# Altium schematic sheet FPGA_Connector_1.SchDoc: BXZ7C01: FPGA Connector 1
size A3; CompanyName: GVI; Address2: 杭州言曼科技有限公司; Address3: www.gvi-tech.com; DocumentNumber: BXZ7C01; Revision: A; SheetNumber: 6; SheetTotal: 10
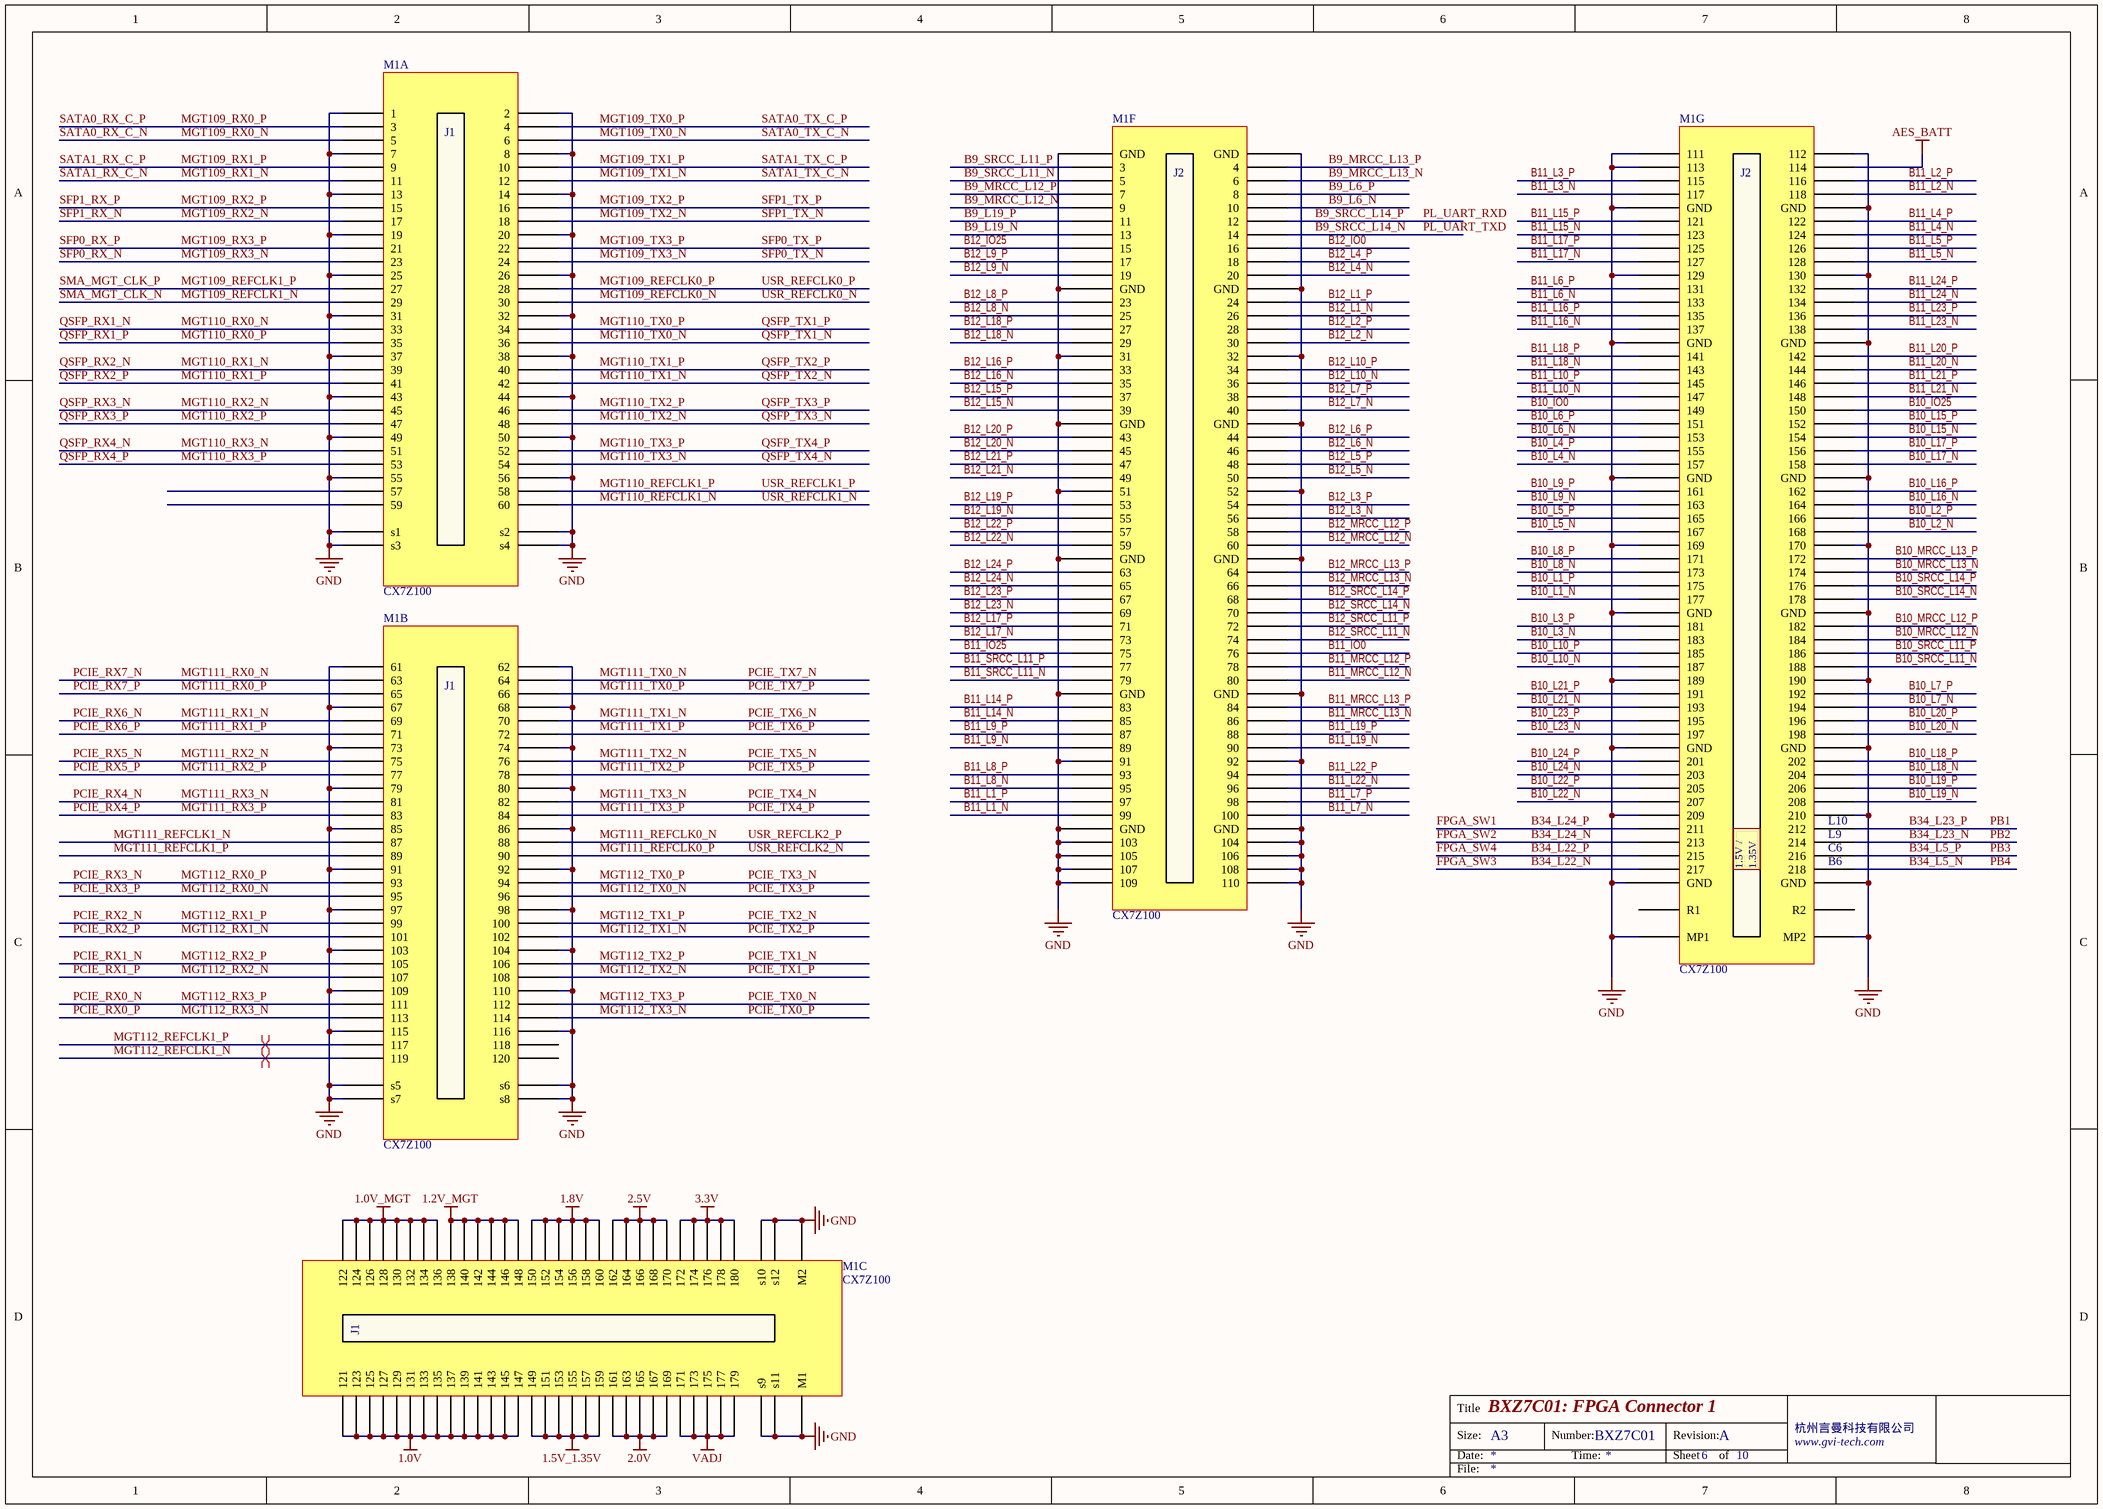
[diagram p0: FPGA_Connector_1.SchDoc]

## Parts
M1  CX7Z100  [GVI_Z7_MiniModule_Socket]  (parts A,B,C,F,G of 8)

## Nets
1.0V: M1.121 M1.123 M1.125 M1.127 M1.129 M1.131 M1.133 M1.135 M1.137 M1.139 M1.141 M1.143 M1.145 M1.147
1.0V_MGT: M1.122 M1.124 M1.126 M1.128 M1.130 M1.132 M1.134 M1.136
1.2V_MGT: M1.138 M1.140 M1.142 M1.144 M1.146 M1.148
1.5V_1.35V: M1.149 M1.151 M1.153 M1.155 M1.157 M1.159
1.8V: M1.150 M1.152 M1.154 M1.156 M1.158 M1.160
2.0V: M1.161 M1.163 M1.165 M1.167 M1.169
2.5V: M1.162 M1.164 M1.166 M1.168 M1.170
3.3V: M1.172 M1.174 M1.176 M1.178 M1.180
AES_BATT: M1.B114(114)
GND: M1.1 M1.2 M1.7 M1.8 M1.13 M1.14 M1.19 M1.20 M1.25 M1.26 M1.31 M1.32 M1.37 M1.38 M1.43 M1.44 M1.49 M1.50 M1.55 M1.56 M1.61 M1.62 M1.67 M1.68 M1.73 M1.74 M1.79 M1.80 M1.85 M1.86 M1.91 M1.92 M1.97 M1.98 M1.103 M1.104 M1.109 M1.110 M1.115 M1.116 M1.B1(GND) M1.B2(GND) M1.B21(GND) M1.B22(GND) M1.B31(31) M1.B32(32) M1.B41(GND) M1.B42(GND) M1.B51(51) M1.B52(52) M1.B61(GND) M1.B62(GND) M1.B81(GND) M1.B82(GND) M1.B91(91) M1.B92(92) M1.B101(GND) M1.B102(GND) M1.B103(103) M1.B104(104) M1.B105(105) M1.B106(106) M1.B107(107) M1.B108(108) M1.B109(109) M1.B110(110) M1.B111(111) M1.B112(112) M1.B113(113) M1.B119(GND) M1.B120(GND) M1.B129(129) M1.B130(130) M1.B139(GND) M1.B140(GND) M1.B159(GND) M1.B160(GND) M1.B169(169) M1.B170(170) M1.B179(GND) M1.B180(GND) M1.B189(189) M1.B190(190) M1.B199(GND) M1.B200(GND) M1.B209(209) M1.B210(210) M1.B219(GND) M1.B220(GND) M1.BMP1(MP1) M1.BMP2(MP2) M1.M1 M1.M2 M1.s1 M1.s2 M1.s3 M1.s4 M1.s5 M1.s6 M1.s7 M1.s8 M1.s9 M1.s10 M1.s11 M1.s12
VADJ: M1.171 M1.173 M1.175 M1.177 M1.179
B9_L6_N: M1.B10(10)
B9_L6_P: M1.B8(8)
B9_L19_N: M1.B13(13)
B9_L19_P: M1.B11(11)
B9_MRCC_L12_N: M1.B9(9)
B9_MRCC_L12_P: M1.B7(7)
B9_MRCC_L13_N: M1.B6(6)
B9_MRCC_L13_P: M1.B4(4)
B9_SRCC_L11_N: M1.B5(5)
B9_SRCC_L11_P: M1.B3(3)
B9_SRCC_L14_N: M1.B14(14)  [also labelled PL_UART_TXD]
B9_SRCC_L14_P: M1.B12(12)  [also labelled PL_UART_RXD]
B10_IO0: M1.B149(149)
B10_IO25: M1.B150(150)
B10_L1_N: M1.B177(177)
B10_L1_P: M1.B175(175)
B10_L2_N: M1.B168(168)
B10_L2_P: M1.B166(166)
B10_L3_N: M1.B183(183)
B10_L3_P: M1.B181(181)
B10_L4_N: M1.B157(157)
B10_L4_P: M1.B155(155)
B10_L5_N: M1.B167(167)
B10_L5_P: M1.B165(165)
B10_L6_N: M1.B153(153)
B10_L6_P: M1.B151(151)
B10_L7_N: M1.B194(194)
B10_L7_P: M1.B192(192)
B10_L8_N: M1.B173(173)
B10_L8_P: M1.B171(171)
B10_L9_N: M1.B163(163)
B10_L9_P: M1.B161(161)
B10_L10_N: M1.B187(187)
B10_L10_P: M1.B185(185)
B10_L15_N: M1.B154(154)
B10_L15_P: M1.B152(152)
B10_L16_N: M1.B164(164)
B10_L16_P: M1.B162(162)
B10_L17_N: M1.B158(158)
B10_L17_P: M1.B156(156)
B10_L18_N: M1.B204(204)
B10_L18_P: M1.B202(202)
B10_L19_N: M1.B208(208)
B10_L19_P: M1.B206(206)
B10_L20_N: M1.B198(198)
B10_L20_P: M1.B196(196)
B10_L21_N: M1.B193(193)
B10_L21_P: M1.B191(191)
B10_L22_N: M1.B207(207)
B10_L22_P: M1.B205(205)
B10_L23_N: M1.B197(197)
B10_L23_P: M1.B195(195)
B10_L24_N: M1.B203(203)
B10_L24_P: M1.B201(201)
B10_MRCC_L12_N: M1.B184(184)
B10_MRCC_L12_P: M1.B182(182)
B10_MRCC_L13_N: M1.B174(174)
B10_MRCC_L13_P: M1.B172(172)
B10_SRCC_L11_N: M1.B188(188)
B10_SRCC_L11_P: M1.B186(186)
B10_SRCC_L14_N: M1.B178(178)
B10_SRCC_L14_P: M1.B176(176)
B11_IO0: M1.B76(76)
B11_IO25: M1.B75(75)
B11_L1_N: M1.B99(99)
B11_L1_P: M1.B97(97)
B11_L2_N: M1.B118(118)
B11_L2_P: M1.B116(116)
B11_L3_N: M1.B117(117)
B11_L3_P: M1.B115(115)
B11_L4_N: M1.B124(124)
B11_L4_P: M1.B122(122)
B11_L5_N: M1.B128(128)
B11_L5_P: M1.B126(126)
B11_L6_N: M1.B133(133)
B11_L6_P: M1.B131(131)
B11_L7_N: M1.B100(100)
B11_L7_P: M1.B98(98)
B11_L8_N: M1.B95(95)
B11_L8_P: M1.B93(93)
B11_L9_N: M1.B89(89)
B11_L9_P: M1.B87(87)
B11_L10_N: M1.B147(147)
B11_L10_P: M1.B145(145)
B11_L14_N: M1.B85(85)
B11_L14_P: M1.B83(83)
B11_L15_N: M1.B123(123)
B11_L15_P: M1.B121(121)
B11_L16_N: M1.B137(137)
B11_L16_P: M1.B135(135)
B11_L17_N: M1.B127(127)
B11_L17_P: M1.B125(125)
B11_L18_N: M1.B143(143)
B11_L18_P: M1.B141(141)
B11_L19_N: M1.B90(90)
B11_L19_P: M1.B88(88)
B11_L20_N: M1.B144(144)
B11_L20_P: M1.B142(142)
B11_L21_N: M1.B148(148)
B11_L21_P: M1.B146(146)
B11_L22_N: M1.B96(96)
B11_L22_P: M1.B94(94)
B11_L23_N: M1.B138(138)
B11_L23_P: M1.B136(136)
B11_L24_N: M1.B134(134)
B11_L24_P: M1.B132(132)
B11_MRCC_L12_N: M1.B80(80)
B11_MRCC_L12_P: M1.B78(78)
B11_MRCC_L13_N: M1.B86(86)
B11_MRCC_L13_P: M1.B84(84)
B11_SRCC_L11_N: M1.B79(79)
B11_SRCC_L11_P: M1.B77(77)
B12_IO0: M1.B16(16)
B12_IO25: M1.B15(15)
B12_L1_N: M1.B26(26)
B12_L1_P: M1.B24(24)
B12_L2_N: M1.B30(30)
B12_L2_P: M1.B28(28)
B12_L3_N: M1.B56(56)
B12_L3_P: M1.B54(54)
B12_L4_N: M1.B20(20)
B12_L4_P: M1.B18(18)
B12_L5_N: M1.B50(50)
B12_L5_P: M1.B48(48)
B12_L6_N: M1.B46(46)
B12_L6_P: M1.B44(44)
B12_L7_N: M1.B40(40)
B12_L7_P: M1.B38(38)
B12_L8_N: M1.B25(25)
B12_L8_P: M1.B23(23)
B12_L9_N: M1.B19(19)
B12_L9_P: M1.B17(17)
B12_L10_N: M1.B36(36)
B12_L10_P: M1.B34(34)
B12_L15_N: M1.B39(39)
B12_L15_P: M1.B37(37)
B12_L16_N: M1.B35(35)
B12_L16_P: M1.B33(33)
B12_L17_N: M1.B73(73)
B12_L17_P: M1.B71(71)
B12_L18_N: M1.B29(29)
B12_L18_P: M1.B27(27)
B12_L19_N: M1.B55(55)
B12_L19_P: M1.B53(53)
B12_L20_N: M1.B45(45)
B12_L20_P: M1.B43(43)
B12_L21_N: M1.B49(49)
B12_L21_P: M1.B47(47)
B12_L22_N: M1.B59(59)
B12_L22_P: M1.B57(57)
B12_L23_N: M1.B69(69)
B12_L23_P: M1.B67(67)
B12_L24_N: M1.B65(65)
B12_L24_P: M1.B63(63)
B12_MRCC_L12_N: M1.B60(60)
B12_MRCC_L12_P: M1.B58(58)
B12_MRCC_L13_N: M1.B66(66)
B12_MRCC_L13_P: M1.B64(64)
B12_SRCC_L11_N: M1.B74(74)
B12_SRCC_L11_P: M1.B72(72)
B12_SRCC_L14_N: M1.B70(70)
B12_SRCC_L14_P: M1.B68(68)
B34_L5_N: M1.B218(218)  [also labelled PB4]
B34_L5_P: M1.B216(216)  [also labelled PB3]
B34_L22_N: M1.B217(217)  [also labelled FPGA_SW3]
B34_L22_P: M1.B215(215)  [also labelled FPGA_SW4]
B34_L23_N: M1.B214(214)  [also labelled PB2]
B34_L23_P: M1.B212(212)  [also labelled PB1]
B34_L24_N: M1.B213(213)  [also labelled FPGA_SW2]
B34_L24_P: M1.B211(211)  [also labelled FPGA_SW1]
MGT109_REFCLK0_N: M1.30  [also labelled USR_REFCLK0_N]
MGT109_REFCLK0_P: M1.28  [also labelled USR_REFCLK0_P]
MGT109_REFCLK1_N: M1.29  [also labelled SMA_MGT_CLK_N]
MGT109_REFCLK1_P: M1.27  [also labelled SMA_MGT_CLK_P]
MGT109_RX0_N: M1.5  [also labelled SATA0_RX_C_N]
MGT109_RX0_P: M1.3  [also labelled SATA0_RX_C_P]
MGT109_RX1_N: M1.11  [also labelled SATA1_RX_C_N]
MGT109_RX1_P: M1.9  [also labelled SATA1_RX_C_P]
MGT109_RX2_N: M1.17  [also labelled SFP1_RX_N]
MGT109_RX2_P: M1.15  [also labelled SFP1_RX_P]
MGT109_RX3_N: M1.23  [also labelled SFP0_RX_N]
MGT109_RX3_P: M1.21  [also labelled SFP0_RX_P]
MGT109_TX0_N: M1.6  [also labelled SATA0_TX_C_N]
MGT109_TX0_P: M1.4  [also labelled SATA0_TX_C_P]
MGT109_TX1_N: M1.12  [also labelled SATA1_TX_C_N]
MGT109_TX1_P: M1.10  [also labelled SATA1_TX_C_P]
MGT109_TX2_N: M1.18  [also labelled SFP1_TX_N]
MGT109_TX2_P: M1.16  [also labelled SFP1_TX_P]
MGT109_TX3_N: M1.24  [also labelled SFP0_TX_N]
MGT109_TX3_P: M1.22  [also labelled SFP0_TX_P]
MGT110_REFCLK1_N: M1.60  [also labelled USR_REFCLK1_N]
MGT110_REFCLK1_P: M1.58  [also labelled USR_REFCLK1_P]
MGT110_RX0_N: M1.33  [also labelled QSFP_RX1_N]
MGT110_RX0_P: M1.35  [also labelled QSFP_RX1_P]
MGT110_RX1_N: M1.39  [also labelled QSFP_RX2_N]
MGT110_RX1_P: M1.41  [also labelled QSFP_RX2_P]
MGT110_RX2_N: M1.45  [also labelled QSFP_RX3_N]
MGT110_RX2_P: M1.47  [also labelled QSFP_RX3_P]
MGT110_RX3_N: M1.51  [also labelled QSFP_RX4_N]
MGT110_RX3_P: M1.53  [also labelled QSFP_RX4_P]
MGT110_TX0_N: M1.36  [also labelled QSFP_TX1_N]
MGT110_TX0_P: M1.34  [also labelled QSFP_TX1_P]
MGT110_TX1_N: M1.42  [also labelled QSFP_TX2_N]
MGT110_TX1_P: M1.40  [also labelled QSFP_TX2_P]
MGT110_TX2_N: M1.48  [also labelled QSFP_TX3_N]
MGT110_TX2_P: M1.46  [also labelled QSFP_TX3_P]
MGT110_TX3_N: M1.54  [also labelled QSFP_TX4_N]
MGT110_TX3_P: M1.52  [also labelled QSFP_TX4_P]
MGT111_REFCLK0_N: M1.88  [also labelled USR_REFCLK2_P]
MGT111_REFCLK0_P: M1.90  [also labelled USR_REFCLK2_N]
MGT111_REFCLK1_N: M1.87
MGT111_REFCLK1_P: M1.89
MGT111_RX0_N: M1.63  [also labelled PCIE_RX7_N]
MGT111_RX0_P: M1.65  [also labelled PCIE_RX7_P]
MGT111_RX1_N: M1.69  [also labelled PCIE_RX6_N]
MGT111_RX1_P: M1.71  [also labelled PCIE_RX6_P]
MGT111_RX2_N: M1.75  [also labelled PCIE_RX5_N]
MGT111_RX2_P: M1.77  [also labelled PCIE_RX5_P]
MGT111_RX3_N: M1.81  [also labelled PCIE_RX4_N]
MGT111_RX3_P: M1.83  [also labelled PCIE_RX4_P]
MGT111_TX0_N: M1.64  [also labelled PCIE_TX7_N]
MGT111_TX0_P: M1.66  [also labelled PCIE_TX7_P]
MGT111_TX1_N: M1.70  [also labelled PCIE_TX6_N]
MGT111_TX1_P: M1.72  [also labelled PCIE_TX6_P]
MGT111_TX2_N: M1.76  [also labelled PCIE_TX5_N]
MGT111_TX2_P: M1.78  [also labelled PCIE_TX5_P]
MGT111_TX3_N: M1.82  [also labelled PCIE_TX4_N]
MGT111_TX3_P: M1.84  [also labelled PCIE_TX4_P]
MGT112_REFCLK1_N: M1.119
MGT112_REFCLK1_P: M1.117
MGT112_RX0_N: M1.95  [also labelled PCIE_RX3_P]
MGT112_RX0_P: M1.93  [also labelled PCIE_RX3_N]
MGT112_RX1_N: M1.101  [also labelled PCIE_RX2_P]
MGT112_RX1_P: M1.99  [also labelled PCIE_RX2_N]
MGT112_RX2_N: M1.107  [also labelled PCIE_RX1_P]
MGT112_RX2_P: M1.105  [also labelled PCIE_RX1_N]
MGT112_RX3_N: M1.113  [also labelled PCIE_RX0_P]
MGT112_RX3_P: M1.111  [also labelled PCIE_RX0_N]
MGT112_TX0_N: M1.96  [also labelled PCIE_TX3_P]
MGT112_TX0_P: M1.94  [also labelled PCIE_TX3_N]
MGT112_TX1_N: M1.102  [also labelled PCIE_TX2_P]
MGT112_TX1_P: M1.100  [also labelled PCIE_TX2_N]
MGT112_TX2_N: M1.108  [also labelled PCIE_TX1_P]
MGT112_TX2_P: M1.106  [also labelled PCIE_TX1_N]
MGT112_TX3_N: M1.114  [also labelled PCIE_TX0_P]
MGT112_TX3_P: M1.112  [also labelled PCIE_TX0_N]

Not connected (* = marked no-connect by the designer): M1 57 59 118 120 BR1(R1) BR2(R2)

## Layout directives
differential pair: MGT112_REFCLK1_N, MGT112_REFCLK1_P

## Notes on the sheet
- (near M1) C6
- (near M1) L10
- (near M1) L9
- (near M1) 1.5V /
- (near M1) 1.35V
- (near M1) B6
- Title
- Size:
- Date:
- A3
- Number:
- Time:
- Revision:
- Sheet
- of
- File:
- (in symbol CX7Z100, part A) J1
- (in symbol CX7Z100, part B) J1
- (in symbol CX7Z100, part C) J1
- (in symbol CX7Z100, part F) J2
- (in symbol CX7Z100, part G) J2

## Library data of the parts
M1 = CX7Z100: Value: 1 x QTH-090-02-L-D-A, 2 x TE 3-6318491-6